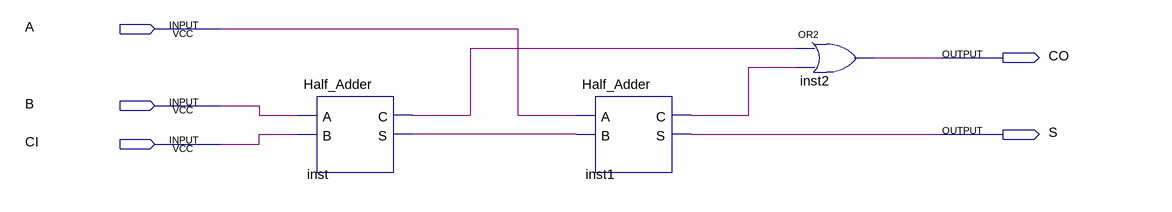
[diagram p0: schematic sheet]
// Quartus schematic Full_Adder.bdf as structural Verilog: 3 symbols, 5 pins
module Full_Adder (
  input  A,
  input  B,
  input  CI,
  output CO,
  output S
);

  wire inst1_c, inst_c, inst_s;

  Half_Adder inst (.A(B), .B(CI), .C(inst_c), .S(inst_s));
  Half_Adder inst1 (.A(A), .B(inst_s), .C(inst1_c), .S(S));
  or inst2 (CO, inst_c, inst1_c);
endmodule
